# Altium schematic sheet 原理图.SchDoc
size A4
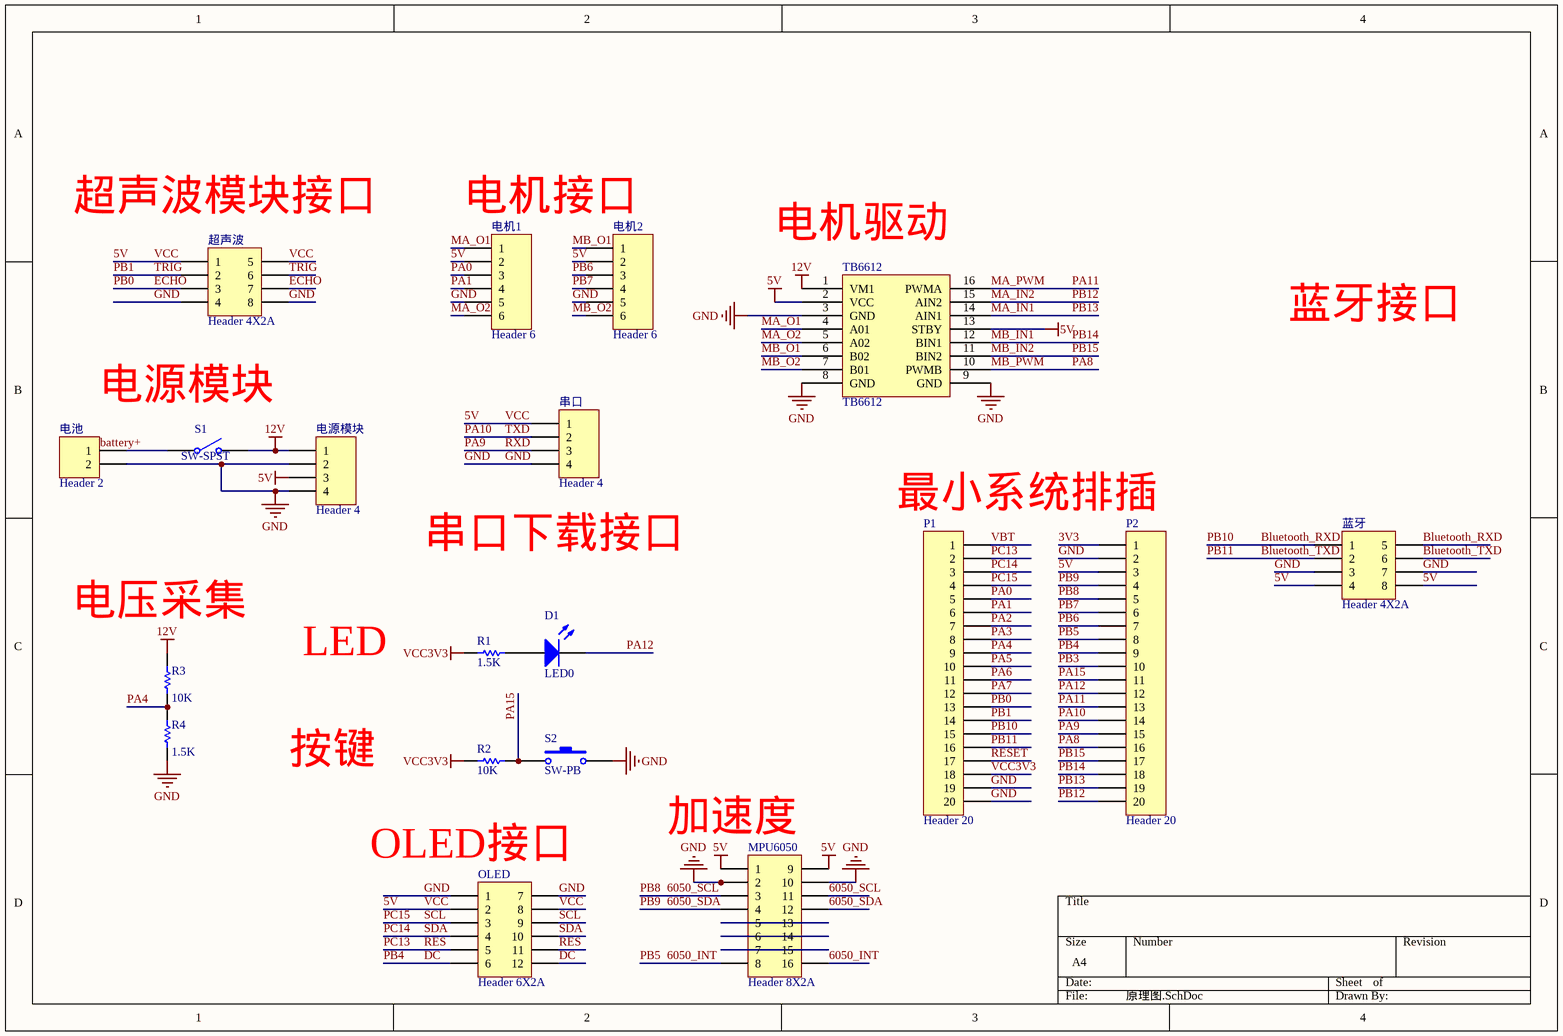
[diagram p0: 原理图.SchDoc]

## Parts
D1  LED0  [LED]
MPU6050  Header 8X2A  [HDR2X8_6050]
OLED  Header 6X2A  [OLED-6PIN]
P1  Header 20  [HDR1X20]
P2  Header 20  [HDR1X20]
R1  value 1.5K  [RES]  (hidden comment: Res Semi)
R2  value 10K  [RES]  (hidden comment: Res Semi)
R3  value 10K  [RES]  (hidden comment: Res Semi)
R4  value 1.5K  [RES]  (hidden comment: Res Semi)
S1  SW-SPST  [SW-4X3]
S2  SW-PB  [SW12*12]
TB6612  TB6612  [TB6612]
串口  Header 4  [HDR1X4]
电机1  Header 6  [HDR1X6 - XH弯]
电机2  Header 6  [HDR1X6 - XH弯]
电池  Header 2  [2P*5.08]
电源模块  Header 4  [LM2596-new]
蓝牙  Header 4X2A  [BLUETOOTH]
超声波  Header 4X2A  [HDR2X4_CEN]

## Nets
5V: MPU6050.1 MPU6050.9 OLED.2 OLED.8 P2.3 TB6612.2(VCC) TB6612.13(STBY) 串口.1 电机1.2 电机2.2 电源模块.3 蓝牙.4 蓝牙.8 超声波.1 超声波.5  [also labelled VCC]
12V: R3.2 S1.2(NO) TB6612.1(VM1) 电源模块.1
GND: MPU6050.2 MPU6050.10 OLED.1 OLED.7 P1.19 P1.20 P2.2 R4.1 S2.2 TB6612.3(GND) TB6612.8(GND) TB6612.9(GND) 串口.4 电机1.5 电机2.5 电池.2 电源模块.2 电源模块.4 蓝牙.3 蓝牙.7 超声波.4 超声波.8
VCC3V3: P1.18 R1.2 R2.2
3V3: P2.1
6050_INT: MPU6050.8 MPU6050.16 P2.8  [also labelled PB5]
6050_SCL: MPU6050.3 MPU6050.11 P2.5  [also labelled PB8]
6050_SDA: MPU6050.4 MPU6050.12 P2.4  [also labelled PB9]
Bluetooth_RXD: P1.15 蓝牙.1 蓝牙.5  [also labelled PB10]
Bluetooth_TXD: P1.16 蓝牙.2 蓝牙.6  [also labelled PB11]
DC: OLED.6 OLED.12 P2.9  [also labelled PB4]
ECHO: P1.13 超声波.3 超声波.7  [also labelled PB0]
MA_IN1: P2.19 TB6612.14(AIN1)  [also labelled PB13]
MA_IN2: P2.20 TB6612.15(AIN2)  [also labelled PB12]
MA_O1: TB6612.4(A01) 电机1.1
MA_O2: TB6612.5(A02) 电机1.6
MA_PWM: P2.13 TB6612.16(PWMA)  [also labelled PA11]
MB_IN1: P2.18 TB6612.12(BIN1)  [also labelled PB14]
MB_IN2: P2.17 TB6612.11(BIN2)  [also labelled PB15]
MB_O1: TB6612.6(B02) 电机2.1
MB_O2: TB6612.7(B01) 电机2.6
MB_PWM: P2.16 TB6612.10(PWMB)  [also labelled PA8]
PA0: P1.5 电机1.3
PA1: P1.6 电机1.4
PA2: P1.7
PA3: P1.8
PA4: P1.9 R3.1 R4.2
PA5: P1.10
PA6: P1.11
PA7: P1.12
PA9: P2.15 串口.3  [also labelled RXD]
PA10: P2.14 串口.2  [also labelled TXD]
PA12: D1.2(K) P2.12
PA15: P2.11 R2.1 S2.1
PB1: P1.14 超声波.2 超声波.6  [also labelled TRIG]
PB3: P2.10
PB6: P2.7 电机2.3
PB7: P2.6 电机2.4
PC13: OLED.5 OLED.11 P1.2  [also labelled RES]
PC14: OLED.4 OLED.10 P1.3  [also labelled SDA]
PC15: OLED.3 OLED.9 P1.4  [also labelled SCL]
RESET: P1.17
VBT: P1.1
NetD1_1: D1.1(A) R1.1
NetMPU6050_5: MPU6050.5 MPU6050.13
NetMPU6050_6: MPU6050.6 MPU6050.14
NetMPU6050_7: MPU6050.7 MPU6050.15
NetS1_1: S1.1(COMMON) 电池.1

## Notes on the sheet
- (near 超声波) 超声波模块接口
- (near 电机1) 电机接口
- (near TB6612) 电机驱动
- 蓝牙接口
- 电源模块
- (near P1) 最小系统排插
- (near 串口) 串口下载接口
- (near R3) 电压采集
- LED
- 按键
- (near MPU6050) 加速度
- (near OLED) OLED接口
- Labels drawn without touching a wire or pin: battery+

## Library data of the parts
D1 = LED0: Typical INFRARED GaAs LED; Published: 8-Jun-2000; LatestRevisionDate: 08-Jul-2005; LatestRevisionNote: Mech Layer 1 removed.; PackageReference: LED-0; Publisher: Altium Limited; PackageDescription: LED; 2 Leads
MPU6050 = Header 8X2A: Header, 8-Pin, Dual row; LatestRevisionDate: 17-Jul-2002; LatestRevisionNote: Re-released for DXP Platform.; Publisher: Altium Limited
OLED = Header 6X2A: Header, 6-Pin, Dual row; LatestRevisionDate: 17-Jul-2002; LatestRevisionNote: Re-released for DXP Platform.; Publisher: Altium Limited
P1 P2 = Header 20: Header, 20-Pin; LatestRevisionDate: 17-Jul-2002; LatestRevisionNote: Re-released for DXP Platform.; Publisher: Altium Limited
R1-R4 = Res Semi: Semiconductor Resistor; Published: 8-Jun-2000; LatestRevisionDate: 17-Jul-2002; LatestRevisionNote: Re-released for DXP Platform.; PackageReference: AXIAL-0.5; Publisher: Altium Limited; PackageDescription: Axial Device, Thru-Hole; 2 Leads; 0.5 in Pin Spacing
S1 = SW-SPST: Single-Pole, Single-Throw Switch; Published: 24-Mar-1999; LatestRevisionDate: 17-Jul-2002; LatestRevisionNote: Re-released for DXP Platform.; PackageReference: SPST-2; Publisher: Altium Limited; PackageDescription: Switch; 2 Leads
S2 = SW-PB: Switch; Published: 24-Mar-1999; LatestRevisionDate: 17-Jul-2002; LatestRevisionNote: Re-released for DXP Platform.; PackageReference: SPST-2; Publisher: Altium Limited; PackageDescription: Switch; 2 Leads
串口 电源模块 = Header 4: Header, 4-Pin; LatestRevisionDate: 17-Jul-2002; LatestRevisionNote: Re-released for DXP Platform.; Publisher: Altium Limited
电机1 电机2 = Header 6: 不用焊; LatestRevisionDate: 17-Jul-2002; LatestRevisionNote: Re-released for DXP Platform.; Publisher: Altium Limited
电池 = Header 2: Header, 2-Pin; LatestRevisionDate: 17-Jul-2002; LatestRevisionNote: Re-released for DXP Platform.; Publisher: Altium Limited
蓝牙 超声波 = Header 4X2A: Header, 4-Pin, Dual row; LatestRevisionDate: 17-Jul-2002; LatestRevisionNote: Re-released for DXP Platform.; Publisher: Altium Limited